# Altium schematic sheet base_station.SchDoc
size A3; SheetNumber: 1; SheetTotal: 1
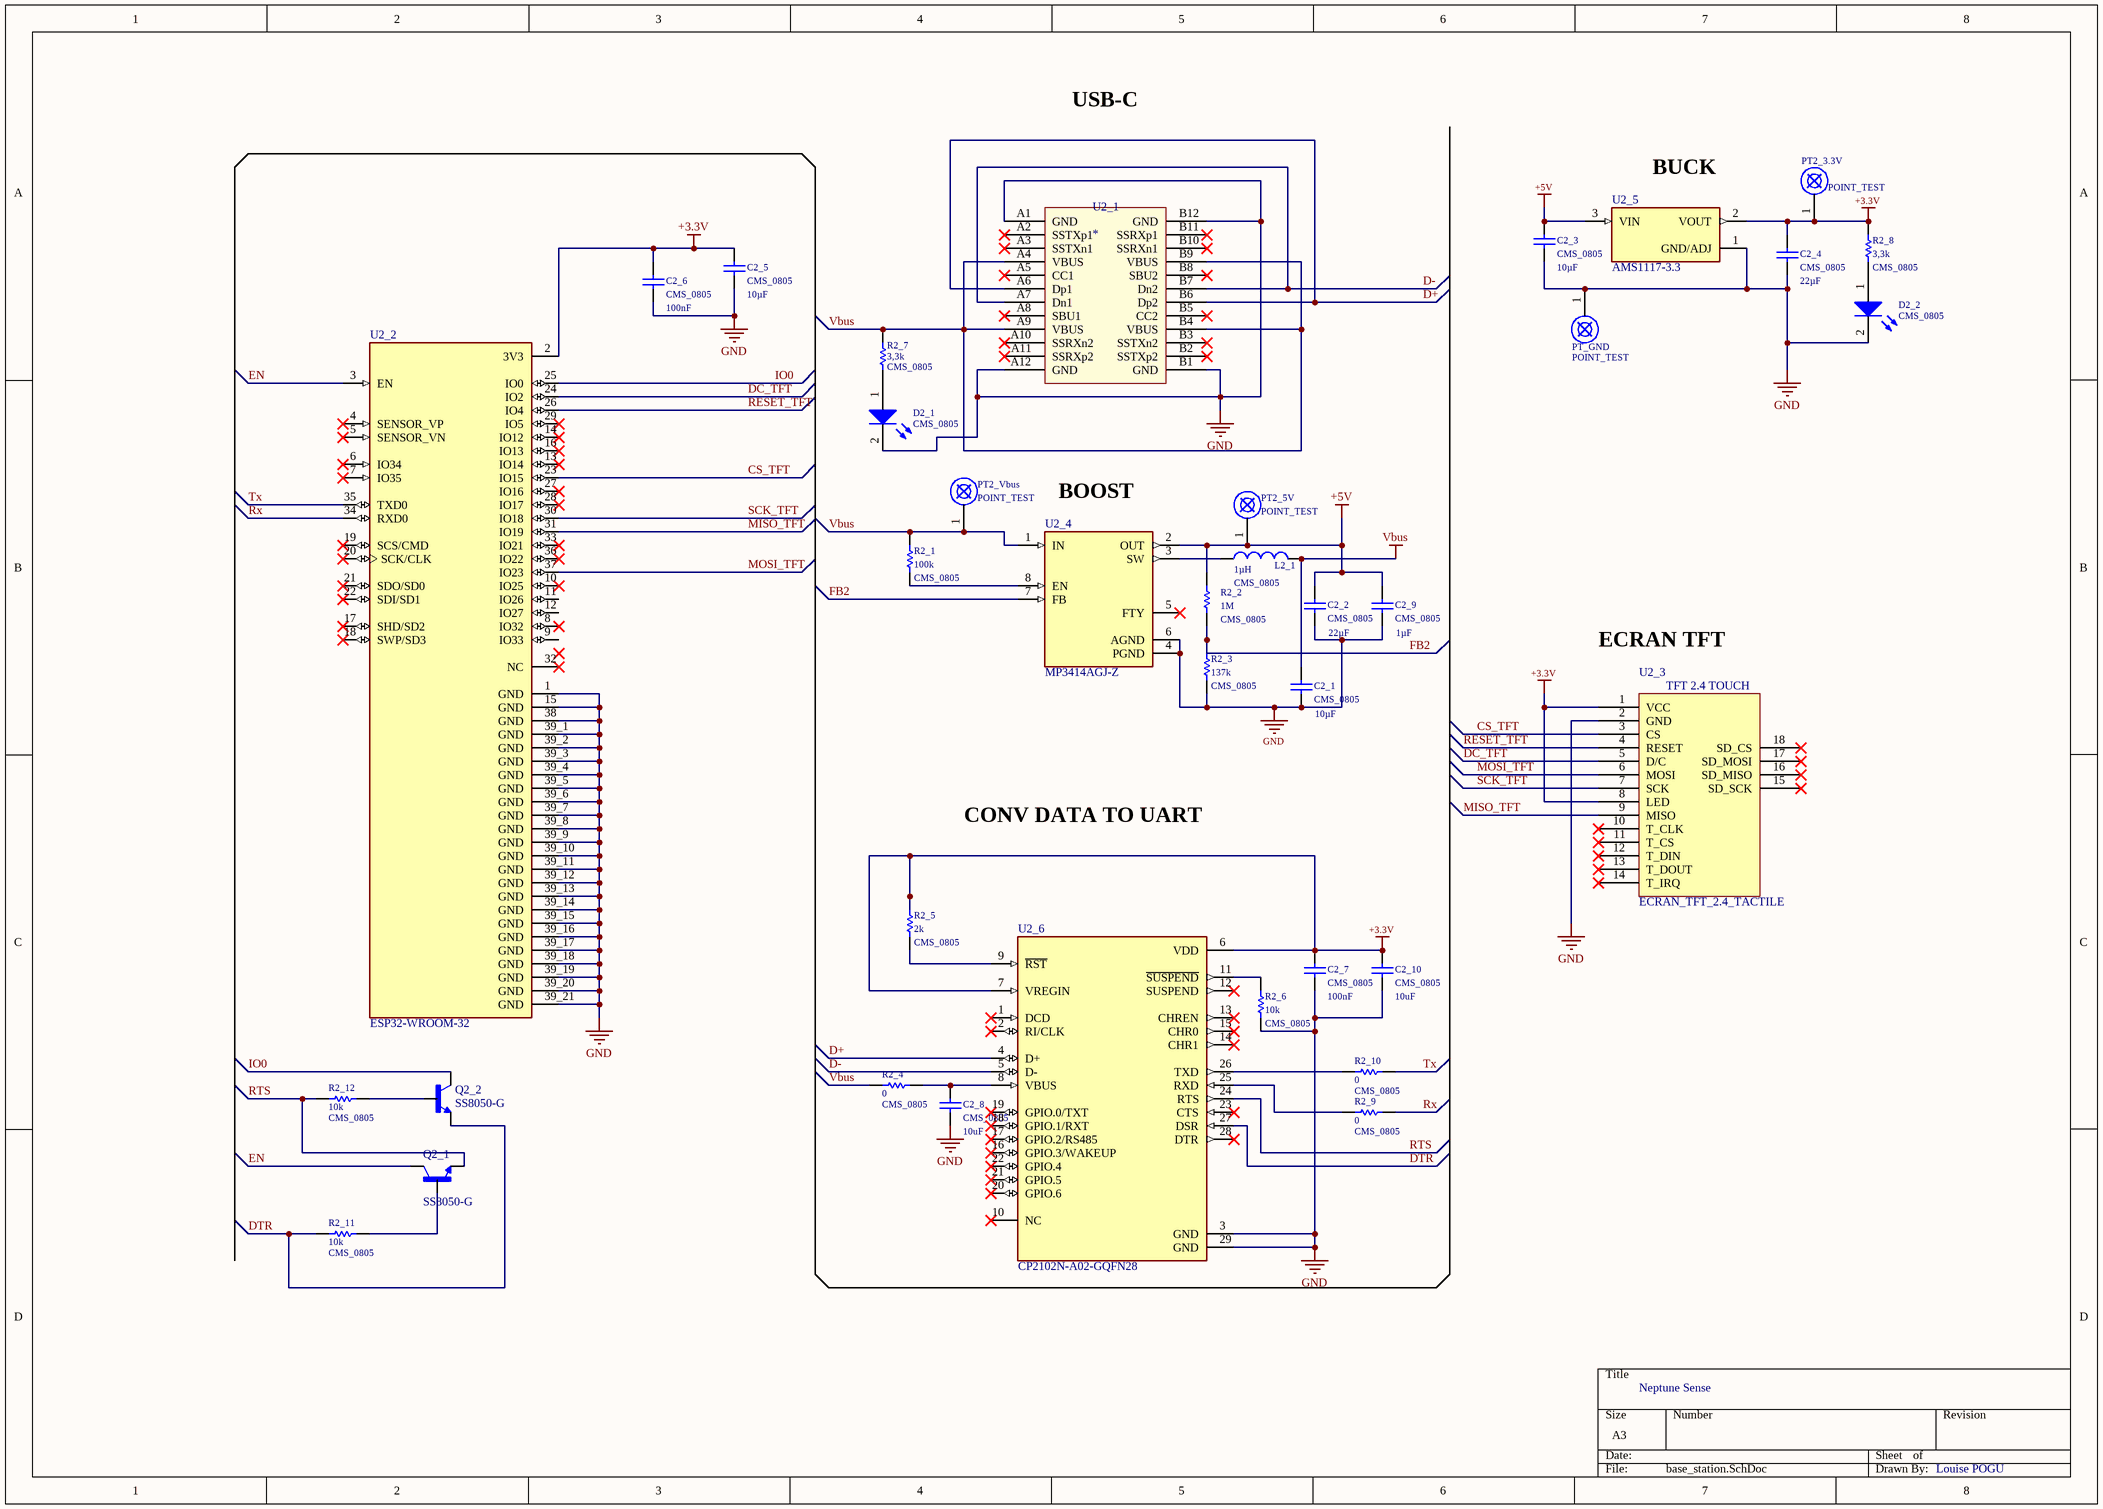
[diagram p0: base_station.SchDoc]

## Parts
C2_1  value 10µF  [CONDENSATEUR_CMS_0805]  (hidden comment: CMS_0805)
C2_2  value 22µF  [CONDENSATEUR_CMS_0805]  (hidden comment: CMS_0805)
C2_3  value 10µF  [CONDENSATEUR_CMS_0805]  (hidden comment: CMS_0805)
C2_4  value 22µF  [CONDENSATEUR_CMS_0805]  (hidden comment: CMS_0805)
C2_5  value 10µF  [CONDENSATEUR_CMS_0805]  (hidden comment: CMS_0805)
C2_6  value 100nF  [CONDENSATEUR_CMS_0805]  (hidden comment: CMS_0805)
C2_7  value 100nF  [CONDENSATEUR_CMS_0805]  (hidden comment: CMS_0805)
C2_8  value 10uF  [CONDENSATEUR_CMS_0805]  (hidden comment: CMS_0805)
C2_9  value 1µF  [CONDENSATEUR_CMS_0805]  (hidden comment: CMS_0805)
C2_10  value 10uF  [CONDENSATEUR_CMS_0805]  (hidden comment: CMS_0805)
D2_1  Type: CMS_0805  [LED_CMS_0805]  (hidden comment: LED_CMS_0805)
D2_2  Type: CMS_0805  [LED_CMS_0805]  (hidden comment: LED_CMS_0805)
L2_1  value 1µH  Type: CMS_0805  [INDUCTANCE_CMS_0805]  (hidden comment: INDUCTANCE_CMS_0805)
PT2_3.3V  POINT_TEST  [POINT_TEST]
PT2_5V  POINT_TEST  [POINT_TEST]
PT2_Vbus  POINT_TEST  [POINT_TEST]
PT_GND  POINT_TEST  [POINT_TEST]
Q2_1  SS8050-G  [TRANS_SS8050-G]
Q2_2  SS8050-G  [TRANS_SS8050-G]
R2_1  value 100k  Type: CMS_0805  [RESISTANCE_CMS_0805]  (hidden comment: RESISTANCE_CMS_0805)
R2_2  value 1M  Type: CMS_0805  [RESISTANCE_CMS_0805]  (hidden comment: RESISTANCE_CMS_0805)
R2_3  value 137k  Type: CMS_0805  [RESISTANCE_CMS_0805]  (hidden comment: RESISTANCE_CMS_0805)
R2_4  value 0  Type: CMS_0805  [RESISTANCE_CMS_0805]  (hidden comment: RESISTANCE_CMS_0805)
R2_5  value 2k  Type: CMS_0805  [RESISTANCE_CMS_0805]  (hidden comment: RESISTANCE_CMS_0805)
R2_6  value 10k  Type: CMS_0805  [RESISTANCE_CMS_0805]  (hidden comment: RESISTANCE_CMS_0805)
R2_7  value 3,3k  Type: CMS_0805  [RESISTANCE_CMS_0805]  (hidden comment: RESISTANCE_CMS_0805)
R2_8  value 3,3k  Type: CMS_0805  [RESISTANCE_CMS_0805]  (hidden comment: RESISTANCE_CMS_0805)
R2_9  value 0  Type: CMS_0805  [RESISTANCE_CMS_0805]  (hidden comment: RESISTANCE_CMS_0805)
R2_10  value 0  Type: CMS_0805  [RESISTANCE_CMS_0805]  (hidden comment: RESISTANCE_CMS_0805)
R2_11  value 10k  Type: CMS_0805  [RESISTANCE_CMS_0805]  (hidden comment: RESISTANCE_CMS_0805)
R2_12  value 10k  Type: CMS_0805  [RESISTANCE_CMS_0805]  (hidden comment: RESISTANCE_CMS_0805)
U2_1  *  [USB]
U2_2  ESP32-WROOM-32  [MODULE_ESP32-WROOM-32]
U2_3  ECRAN_TFT_2.4_TACTILE  [ECRAN_TFT_2.4_TACTILE]
U2_4  MP3414AGJ-Z  [SOT65P280X100-8N]
U2_5  AMS1117-3.3  [SOT229P700X180-4N]
U2_6  CP2102N-A02-GQFN28  [QFN50P500X500X80-29N]

## Nets
+3.3V: C2_4.2 C2_5.2 C2_6.2 C2_7.2 C2_10.2 PT2_3.3V.1 R2_5.2 R2_8.2 U2_2.2(3V3) U2_3.1(VCC) U2_3.8(LED) U2_5.2(VOUT) U2_6.6(VDD) U2_6.7(VREGIN)
+5V: C2_2.2 C2_3.1 C2_9.2 PT2_5V.1 R2_2.2 U2_4.2(OUT) U2_5.3(VIN)
GND: C2_1.1 C2_2.1 C2_3.2 C2_4.1 C2_5.1 C2_6.1 C2_7.1 C2_8.1 C2_9.1 C2_10.1 D2_1.2 D2_2.2 PT_GND.1 R2_3.1 R2_6.1 U2_1.A1(GND) U2_1.A12(GND) U2_1.B1(GND) U2_1.B12(GND) U2_2.1(GND) U2_2.15(GND) U2_2.38(GND) U2_2.39_1(GND) U2_2.39_2(GND) U2_2.39_3(GND) U2_2.39_4(GND) U2_2.39_5(GND) U2_2.39_6(GND) U2_2.39_7(GND) U2_2.39_8(GND) U2_2.39_9(GND) U2_2.39_10(GND) U2_2.39_11(GND) U2_2.39_12(GND) U2_2.39_13(GND) U2_2.39_14(GND) U2_2.39_15(GND) U2_2.39_16(GND) U2_2.39_17(GND) U2_2.39_18(GND) U2_2.39_19(GND) U2_2.39_20(GND) U2_2.39_21(GND) U2_3.2(GND) U2_4.4(PGND) U2_4.6(AGND) U2_5.1(GND/ADJ) U2_6.3(GND) U2_6.29(GND)
Vbus: C2_1.2 L2_1.2 PT2_Vbus.1 R2_1.2 R2_4.2 R2_7.1 U2_1.A4(VBUS) U2_1.A9(VBUS) U2_1.B4(VBUS) U2_1.B9(VBUS) U2_4.1(IN)
CS_TFT: U2_2.23(IO15) U2_3.3(CS)
D+: U2_1.A6(Dp1) U2_1.B6(Dp2) U2_6.4(D+)
D-: U2_1.A7(Dn1) U2_1.B7(Dn2) U2_6.5(D-)
DC_TFT: U2_2.24(IO2) U2_3.5(D/C)
DTR: Q2_2.2(E) R2_11.2 U2_6.27(DSR)
EN: Q2_1.3(C) U2_2.3(EN)
FB2: R2_2.1 R2_3.2 U2_4.7(FB)
IO0: Q2_2.3(C) U2_2.25(IO0)
MISO_TFT: U2_2.31(IO19) U2_3.9(MISO)
MOSI_TFT: U2_2.37(IO23) U2_3.6(MOSI)
RESET_TFT: U2_2.26(IO4) U2_3.4(RESET)
RTS: Q2_1.2(E) R2_12.2 U2_6.24(RTS)
Rx: R2_9.1 U2_2.34(RXD0)
SCK_TFT: U2_2.30(IO18) U2_3.7(SCK)
Tx: R2_10.1 U2_2.35(TXD0)
NetC2_8_2: C2_8.2 R2_4.1 U2_6.8(VBUS)
NetD2_1_1: D2_1.1 R2_7.2
NetD2_2_1: D2_2.1 R2_8.1
NetL2_1_1: L2_1.1 U2_4.3(SW)
NetQ2_1_1: Q2_1.1(B) R2_11.1
NetQ2_2_1: Q2_2.1(B) R2_12.1
NetR2_1_1: R2_1.1 U2_4.8(EN)
NetR2_5_1: R2_5.1 U2_6.9(~{RST})
NetR2_6_2: R2_6.2 U2_6.11(~{SUSPEND})
NetR2_9_2: R2_9.2 U2_6.25(RXD)
NetR2_10_2: R2_10.2 U2_6.26(TXD)

Not connected (* = marked no-connect by the designer): U2_1 A2(SSTXp1)* A3(SSTXn1)* A5(CC1)* A8(SBU1)* A10(SSRXn2)* A11(SSRXp2)* B2(SSTXp2)* B3(SSTXn2)* B5(CC2)* B8(SBU2)* B10(SSRXn1)* B11(SSRXp1)*; U2_2 4(SENSOR_VP)* 5(SENSOR_VN)* 6(IO34)* 7(IO35)* 8(IO32)* 9(IO33) 10(IO25)* 11(IO26) 12(IO27) 13(IO14)* 14(IO12)* 16(IO13)* 17(SHD/SD2)* 18(SWP/SD3)* 19(SCS/CMD)* 20(SCK/CLK)* 21(SDO/SD0)* 22(SDI/SD1)* 27(IO16)* 28(IO17)* 29(IO5)* 32(NC)* 33(IO21)* 36(IO22)*; U2_3 10(T_CLK)* 11(T_CS)* 12(T_DIN)* 13(T_DOUT)* 14(T_IRQ)* 15(SD_SCK)* 16(SD_MISO)* 17(SD_MOSI)* 18(SD_CS)*; U2_4 5(FTY)*; U2_6 1(DCD)* 2(RI/CLK)* 10(NC)* 12(SUSPEND)* 13(CHREN)* 14(CHR1)* 15(CHR0)* 16(GPIO.3/WAKEUP)* 17(GPIO.2/RS485)* 18(GPIO.1/RXT)* 19(GPIO.0/TXT)* 20(GPIO.6)* 21(GPIO.5)* 22(GPIO.4)* 23(CTS)* 28(DTR)*

## Notes on the sheet
- USB-C
- (near U2_5) BUCK
- (near U2_4) BOOST
- ECRAN TFT
- CONV DATA TO UART
- Neptune Sense
- Louise POGU
- (in symbol ECRAN_TFT_2.4_TACTILE) TFT 2.4 TOUCH

## Library data of the parts
C2_1-C2_10 = CONDENSATEUR_CMS_CER_0805: CONDENSATEUR CMS CERAMIQUE 0805; Type: CMS_0805
D2_1 D2_2 = LED_CMS_0805: LED CMS 0805
L2_1 = INDUCTANCE_CMS_0805: INDUCTANCE CMS 0805
PT2_3.3V PT2_5V PT2_Vbus PT_GND = CMP-118-000011-1: POINT TEST; Source: connecteurs.SchLib; Design Item ID: POINT_TEST
Q2_1 Q2_2 = CMP-202-000000-1: Bipolar (BJT) Transistor NPN 25 V 1.5 A 100MHz 300 mW Surface Mount SOT-23-3; MP: SS8050G; MF: Comchip; SnapEDA_Link: https://www.snapeda.com/parts/SS8050G/Comchip/view-part/?ref=snap; Value: *; Design Item ID: SS8050-G; Source: SS8050-G.SchLib; Component Type: Standard; Pin Count: 3; Digi-Key_Part_Number: 641-1790-2-ND; Package: None
R2_1-R2_12 = RESISTANCE_CMS_0805: RESISTANCE CMS 0805
U2_1 = USB
U2_2 = CMP-184-000000-1: Bluetooth, WiFi 802.11b/g/n, Bluetooth v4.2 +EDR, Class 1, 2 and 3 Transceiver Module 2.4GHz ~ 2.5GHz Antenna Not Included, U.FL Surface Mount; MF: Espressif Systems; Package: Module Espressif Systems; Purchase-URL: https://pricing.snapeda.com/search/part/ESP32-WROOM-32/?ref=eda; Design Item ID: ESP32-WROOM-32; Value: *; Availability: In Stock; Component Type: Standard; Source: ESP32-WROOM-32.SchLib; Pin Count: 59; MP: ESP32-WROOM-32; Price: None; SnapEDA_Link: https://www.snapeda.com/parts/ESP32-WROOM-32/Espressif+Systems/view-part/?ref=snap
U2_4 = CMP-156-000001-1: Boost Switching Regulator IC Positive Adjustable 2V 1 Output 3A SOT-23-8; MF: Monolithic Power; Price: None; Design Item ID: MP3414AGJ-Z; Component Type: Standard; Pin Count: 8; Availability: Unavailable; SnapEDA_Link: https://www.snapeda.com/parts/MP3414AGJ-Z/Monolithic%20Power%20Systems%20Inc./view-part/1062936/?ref=snap; Value: *; Package: TSOT-23 MPS; Source: SnapEDAsch.SchLib; MP: MP3414AGJ-Z
U2_5 = CMP-154-000000-1: LDO Voltage Regulators 800MA LDO LINEAR REG; MF: ams AG; Design Item ID: AMS1117-3.3; Price: None; Source: AMS1117-3.3.SchLib; MP: AMS1117-3.3; Package: SOT-223 Seeed Technology; Value: *; Component Type: Standard; SnapEDA_Link: https://www.snapeda.com/parts/AMS1117-3.3/AMS+AG/view-part/?ref=snap; Pin Count: 3; Purchase-URL: https://pricing.snapeda.com/search/part/AMS1117-3.3/?ref=eda; Availability: In Stock
U2_6 = CMP-186-000000-1: USB Bridge, USB to UART USB 2.0 UART Interface 28-QFN (5x5); MF: Silicon Labs; Package: WFQFN-28 Silicon Labs; Availability: In Stock; Source: CP2102N-A02-GQFN28.SchLib; MP: CP2102N-A02-GQFN28; Price: None; Value: *; Component Type: Standard; Pin Count: 29; Design Item ID: CP2102N-A02-GQFN28; Purchase-URL: https://pricing.snapeda.com/search/part/CP2102N-A02-GQFN28/?ref=eda; SnapEDA_Link: https://www.snapeda.com/parts/CP2102N-A02-GQFN28/Silicon+Labs/view-part/?ref=snap